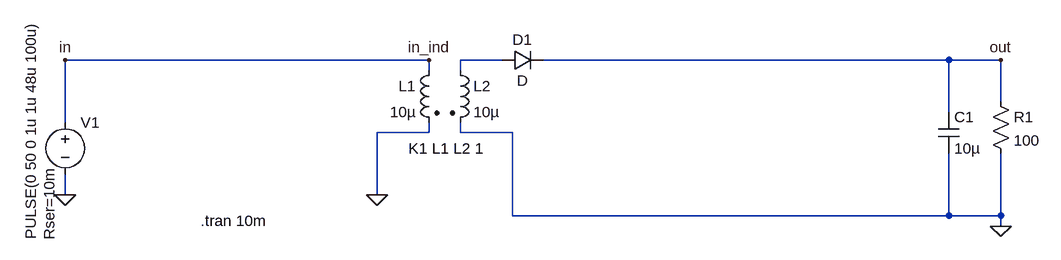
[diagram p0: schematic flyback-converter.asc]
flyback-converter.asc, the LTspice schematic file:
Version 4
SHEET 1 1092 680
WIRE 144 32 -416 32
WIRE 256 32 192 32
WIRE 944 32 320 32
WIRE 1024 32 944 32
WIRE 144 48 144 32
WIRE 192 48 192 32
WIRE 1024 96 1024 32
WIRE 944 112 944 32
WIRE -416 128 -416 32
WIRE 144 144 144 128
WIRE 144 144 64 144
WIRE 192 144 192 128
WIRE 272 144 192 144
WIRE -416 240 -416 208
WIRE 64 240 64 144
WIRE 272 272 272 144
WIRE 944 272 944 176
WIRE 944 272 272 272
WIRE 1024 272 1024 176
WIRE 1024 272 944 272
WIRE 1024 288 1024 272
FLAG -416 240 0
FLAG 64 240 0
FLAG -416 32 in
FLAG 1024 32 out
FLAG 1024 288 0
FLAG 144 32 in_ind
SYMBOL voltage -416 112 R0
WINDOW 123 0 0 Left 0
WINDOW 39 -25 197 VLeft 2
WINDOW 3 -53 197 VLeft 2
SYMATTR SpiceLine Rser=10m
SYMATTR Value PULSE(0 50 0 1u 1u 48u 100u)
SYMATTR InstName V1
SYMBOL ind2 160 32 M0
SYMATTR InstName L1
SYMATTR Value 10µ
SYMATTR Type ind
SYMBOL ind2 176 32 R0
SYMATTR InstName L2
SYMATTR Value 10µ
SYMATTR Type ind
SYMBOL res 1008 80 R0
SYMATTR InstName R1
SYMATTR Value 100
SYMBOL cap 928 112 R0
SYMATTR InstName C1
SYMATTR Value 10µ
SYMBOL diode 256 48 R270
WINDOW 0 32 32 VTop 2
WINDOW 3 0 32 VBottom 2
SYMATTR InstName D1
TEXT 112 168 Left 2 !K1 L1 L2 1
TEXT -208 280 Left 2 !.tran 10m

The netlist it stands for:
* flyback-converter.asc
V1 in_ind 0 PULSE(0 50 0 1u 1u 48u 100u) Rser=10m
L1 in_ind 0 10µ
L2 N001 0 10µ
R1 out 0 100
C1 out 0 10µ
D1 N001 out D
.model D D
.lib standard.dio
K1 L1 L2 1
.tran 10m
.backanno
.end